# Altium schematic sheet 13.SchDoc
size 297 x 209 mm
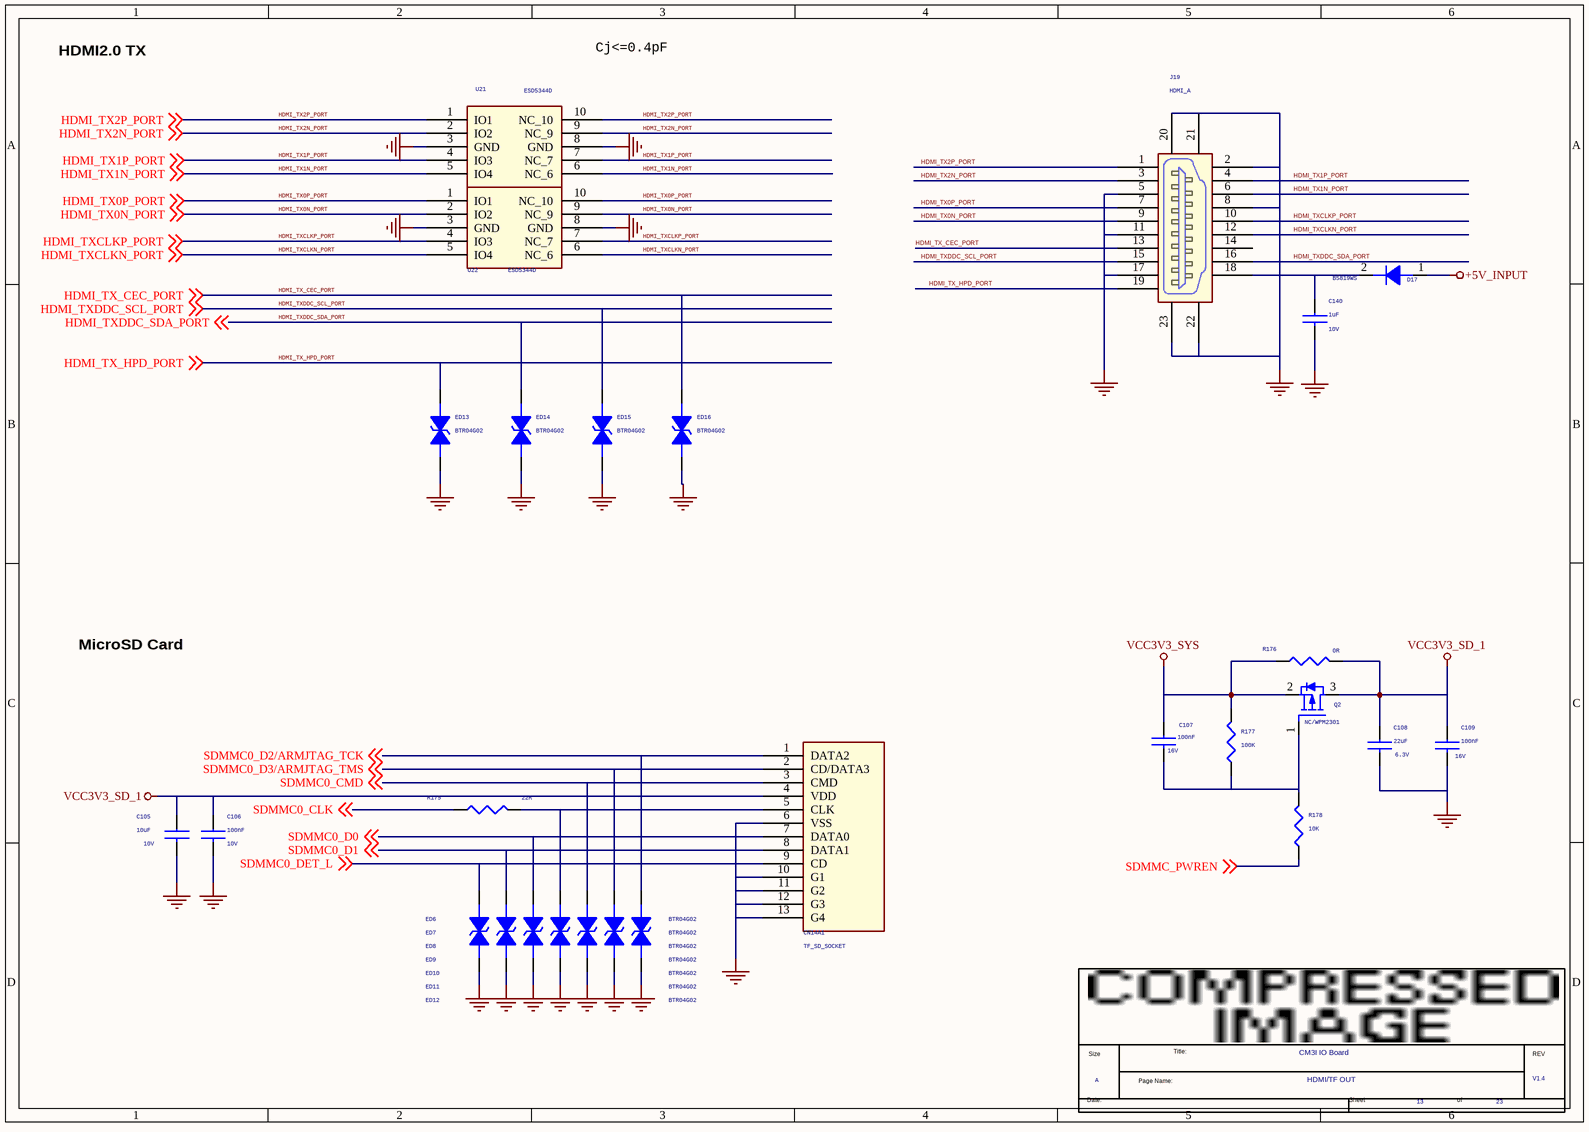
[diagram p0: 13.SchDoc]

## Parts
*  Page Count: 23  Page Number: 13  Page Size: A  Title: CM3I IO Board  RevCode: V1.4  Doc: HDMI/TF OUT  (hidden comment: radxa_1010)  (graphical)
C105  10uF  Voltage: 10V  [C0603]
C106  100nF  Voltage: 10V  [C0402]
C107  100nF  Voltage: 16V  [C0402]
C108  22uF  Voltage: 6.3V  [C0603]
C109  100nF  Voltage: 16V  [C0402]
C140  1uF  Voltage: 10V  [C0402]
CN14A1  TF_SD_SOCKET  [TF-CKT01-009D]
D17  B5819WS  [SOD_323]
ED6  BTR04G02  [E0402N]
ED7  BTR04G02  [E0402N]
ED8  BTR04G02  [E0402N]
ED9  BTR04G02  [E0402N]
ED10  BTR04G02  [E0402N]
ED11  BTR04G02  [E0402N]
ED12  BTR04G02  [E0402N]
ED13  BTR04G02  [ESD0402_1xD5]
ED14  BTR04G02  [ESD0402_1xD5]
ED15  BTR04G02  [ESD0402_1xD5]
ED16  BTR04G02  [ESD0402_1xD5]
J19  HDMI_A  [HDMIA19S]
Q2  NC/WPM2301  [SOT23]
R175  22R  [R0402]
R176  0R  [R0402]
R177  100K  [R0402]
R178  10K  [R0402]
U21  ESD5344D  [SON10_2R50X1R00X0R50]
U22  ESD5344D  [SON10_2R50X1R00X0R50]

## Nets
+5V_INPUT: D17.1(A)
GND: C105.2 C106.2 C108.2 C109.2 C140.2 CN14A1.6(VSS) CN14A1.10(G1) CN14A1.11(G2) CN14A1.12(G3) CN14A1.13(G4) ED6.2 ED7.2 ED8.2 ED9.2 ED10.2 ED11.2 ED12.2 ED13.2 ED14.2 ED15.2 ED16.2 J19.2 J19.5 J19.8 J19.11 J19.17 J19.20 J19.21 J19.22 J19.23 U21.3(GND) U21.8(GND) U22.3(GND) U22.8(GND)
VCC3V3_SD_1: C105.1 C106.1 C108.1 C109.1 CN14A1.4(VDD) Q2.3(DRAIN) R176.2
VCC3V3_SYS: C107.1 Q2.2(SOURCE) R176.1 R177.1
HDMI_TX0N_PORT: J19.9 U22.2(IO2) U22.9(NC_9) ; off-sheet HDMI_TX0N_PORT
HDMI_TX0P_PORT: J19.7 U22.1(IO1) U22.10(NC_10) ; off-sheet HDMI_TX0P_PORT
HDMI_TX1N_PORT: J19.6 U21.5(IO4) U21.6(NC_6) ; off-sheet HDMI_TX1N_PORT
HDMI_TX1P_PORT: J19.4 U21.4(IO3) U21.7(NC_7) ; off-sheet HDMI_TX1P_PORT
HDMI_TX2N_PORT: J19.3 U21.2(IO2) U21.9(NC_9) ; off-sheet HDMI_TX2N_PORT
HDMI_TX2P_PORT: J19.1($PIN0) U21.1(IO1) U21.10(NC_10) ; off-sheet HDMI_TX2P_PORT
HDMI_TX_CEC_PORT: ED16.1 J19.13 ; off-sheet HDMI_TX_CEC_PORT
HDMI_TX_HPD_PORT: ED13.1 J19.19 ; off-sheet HDMI_TX_HPD_PORT
HDMI_TXCLKN_PORT: J19.12 U22.5(IO4) U22.6(NC_6) ; off-sheet HDMI_TXCLKN_PORT
HDMI_TXCLKP_PORT: J19.10 U22.4(IO3) U22.7(NC_7) ; off-sheet HDMI_TXCLKP_PORT
HDMI_TXDDC_SCL_PORT: ED15.1 J19.15 ; off-sheet HDMI_TXDDC_SCL_PORT
HDMI_TXDDC_SDA_PORT: ED14.1 J19.16 ; off-sheet HDMI_TXDDC_SDA_PORT
SDMMC0_CLK: R175.1 ; off-sheet SDMMC0_CLK
SDMMC0_CMD: CN14A1.3(CMD) ED10.1 ; off-sheet SDMMC0_CMD
SDMMC0_D0: CN14A1.7(DATA0) ED8.1 ; off-sheet SDMMC0_D0
SDMMC0_D1: CN14A1.8(DATA1) ED7.1 ; off-sheet SDMMC0_D1
SDMMC0_D2/ARMJTAG_TCK: CN14A1.1(DATA2) ED12.1 ; off-sheet SDMMC0_D2/ARMJTAG_TCK
SDMMC0_D3/ARMJTAG_TMS: CN14A1.2(CD/DATA3) ED11.1 ; off-sheet SDMMC0_D3/ARMJTAG_TMS
SDMMC0_DET_L: CN14A1.9(CD) ED6.1 ; off-sheet SDMMC0_DET_L
SDMMC_PWREN: R178.2 ; off-sheet SDMMC_PWREN
NetC107_2: C107.2 Q2.1(GATE) R177.2 R178.1
NetC140_1: C140.1 D17.2(K) J19.18
NetCN14A1_5: CN14A1.5(CLK) ED9.1 R175.2

Not connected (* = marked no-connect by the designer): J19 14

## Notes on the sheet
- HDMI2.0 TX
- Cj<=0.4pF
- MicroSD Card
- (in symbol radxa_1010) Title:; Size; REV; Page Name:; Date:; Sheet; of

## Library data of the parts
C105 = CAP NP_0: cap,10.00uF,+/-10%,10V,X5R,C0603; Manufacturer: TDK; RK PN: C1608X5R1A106K080AC; Priority: A; C_Voltage: 6.3V; Tolerance: 10%; Dielectric: X5R; Part Type: C0603; Manufacturer PN: C1608X5R1A106K080AC; Created by: JJJ
C106 = CAP NP_0: cap,100.00nF,+/-10%,10V,X5R,C0402; Manufacturer: TDK; RK PN: C1005X5R1A104K050BA; Priority: A; Tolerance: 10%; C_Voltage: 6.3V; Dielectric: X5R; Part Type: C0402; Manufacturer PN: C1005X5R1A104K050BA; Created by: JJJ
C107 C109 = CAP NP_0: cap,100.00nF,+/-10%,16V,X5R,C0402; Manufacturer PN: C1005X5R1C104K050BA; Manufacturer: TDK; Tolerance: 10%; Priority: A; Dielectric: X5R; Created by: JJJ; Part Type: C0402; RK PN: C1005X5R1C104K050BA
C108 = CAP NP_0: cap,10.00uF,+/-10%,6.3V,X5R,C0603; Manufacturer: TDK; RK PN: C1608X5R0J106K080AB; Priority: A; Tolerance: 10%; Dielectric: X5R; Part Type: C0603; Manufacturer PN: C1608X5R0J106K080AB; Created by: JJJ
C140 = CAP NP_0: cap,1.00uF,+/-10%,10V,X5R,C0402; Manufacturer PN: C1005X5R1A105K050BB; Manufacturer: TDK; Tolerance: 10%; Priority: A; Dielectric: X5R; Created by: JJJ; Part Type: C0402; RK PN: C1005X5R1A105K050BB
CN14A1 = SD_SOCKET_0
D17 = DIODE_Dup2: Schottky Barrier，B5819WS SOD-323; Manufacturer: 长电; Priority: A; RK PN: B5819WS; Part Type: Schottky rectifier; Manufacturer PN: B5819WS; Created by: JJJ
ED6-ED12 = DIODE BI-DIR TRIG: ESD
ED13-ED16 = DIODE BI_DIR TRIG_0: 1-Line, Bi-directional, Transient Voltage Suppressors.17.5pF.; Manufacturer: WillSemi(韦尔半导体); RK PN: ESD5451N; Priority: A; Part Type: ESD_TVS; Manufacturer PN: ESD5451N; Created by: JJJ
J19 = HDMI_A: 通用A型HDMI座,卧式,侧插; Manufacturer: 旺科达; Priority: A; RK PN: HDMI_A; Part Type: HDMI Jack; Manufacturer Part Number: HDMI_A; Created by: JJJ
Q2 = MOSFET P_Dup1: PMOS,WPM3407-3/TR,SOT_23,Id=4.4A,Vds=30V; Manufacturer: WillSemi(韦尔半导体); Pd: 0.9W; Vgsth: 2.0V; VDS: 30V; Vgs: ±20V; Id_max: 4.4A; Priority: A; Created by: JJJ; Manufacturer PN: WPM3407-3/TR; Part Type: PMOS; RK PN: WPM3407-3/TR
R175 = RESISTOR_1_Dup1
R176 = RESISTOR_0_Dup1: 通用厚膜电阻,0R,+/-5%,R0402,1/16W.; Manufacturer PN: RC0402JR-070RL; Manufacturer: YAGEO; Tolerance: 5%; Wattage: 1/16W; Priority: A; Created by: YTL; Part Type: 通用厚膜电阻; RK PN: RC0402JR-070RL
R177 = RESISTOR_0_Dup1: 通用厚膜电阻,100K,+/-5%,R0402,1/16W.; Manufacturer: YAGEO; Tolerance: 5%; RK PN: RC0402JR-07100KL; Priority: A; Wattage: 1/16W; Part Type: 通用厚膜电阻; Manufacturer PN: RC0402JR-07100KL; Created by: YTL
R178 = RESISTOR_0_Dup1: 通用厚膜电阻,10K,+/-5%,R0402,1/16W.; Manufacturer: YAGEO; Tolerance: 5%; RK PN: RC0402JR-0710KL; Priority: A; Wattage: 1/16W; Part Type: 通用厚膜电阻; Manufacturer PN: RC0402JR-0710KL; Created by: YTL
U21 U22 = ESD_ESD5304D: 4-Lines, Uni-directional, Ultra-low Capacitance Transient Voltage Suppressors; Manufacturer: WillSemi(韦尔半导体); Priority: A; RK PN: ESD5304D; Part Type: ESD_TVS; Manufacturer PN: ESD5304D; Created by: JJJ
* = radxa_1010: Page Create Date: March  8, 1995